# Altium schematic sheet reciever.SchDoc
size A
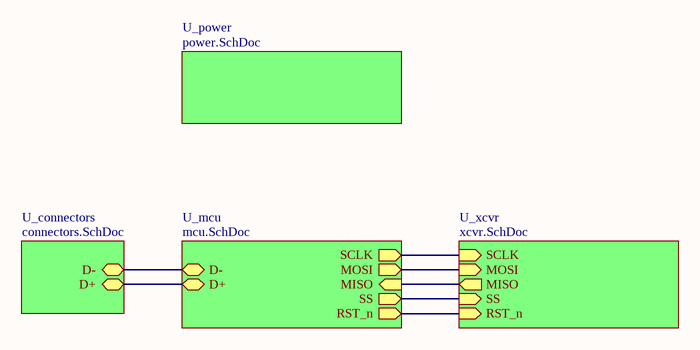
[diagram p0: reciever.SchDoc]

## Sub-sheets
U_connectors = connectors.SchDoc: D- (bidir), D+ (bidir)
U_mcu = mcu.SchDoc: SCLK (out), MOSI (out), MISO (in), SS (out), D- (bidir), D+ (bidir), RST_n (out)
U_power = power.SchDoc: no entries
U_xcvr = xcvr.SchDoc: SCLK (in), MOSI (in), MISO (out), SS (in), RST_n (in)

## Nets
(unnamed): sheet U_mcu/SCLK, sheet U_xcvr/SCLK
(unnamed): sheet U_mcu/MOSI, sheet U_xcvr/MOSI
(unnamed): sheet U_mcu/MISO, sheet U_xcvr/MISO
(unnamed): sheet U_mcu/SS, sheet U_xcvr/SS
(unnamed): sheet U_mcu/D-, sheet U_connectors/D-
(unnamed): sheet U_mcu/D+, sheet U_connectors/D+
(unnamed): sheet U_mcu/RST_n, sheet U_xcvr/RST_n